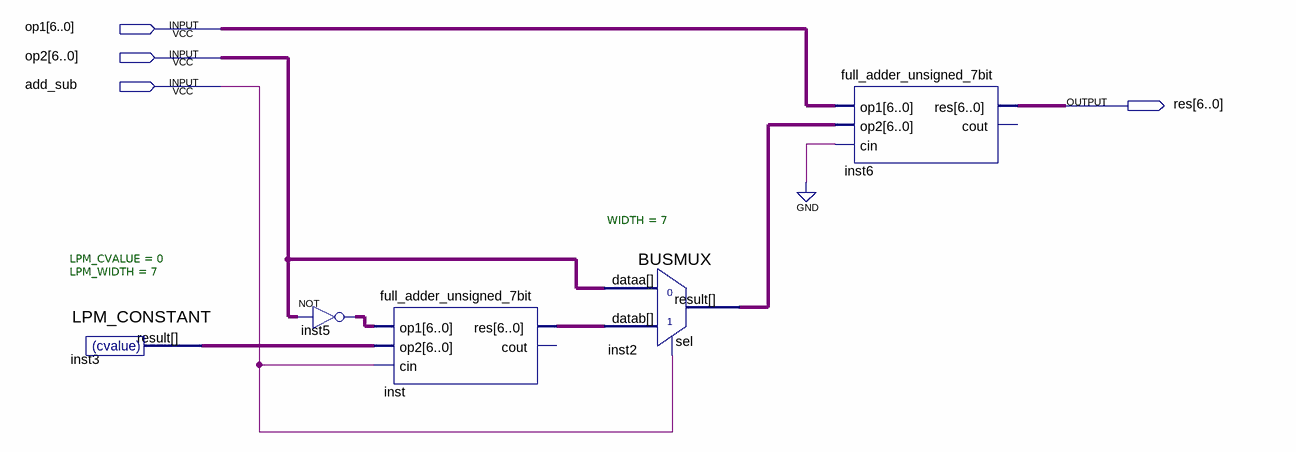
[diagram p0: schematic sheet]
// Quartus schematic addition_subtraction_7bit.bdf as structural Verilog: 5 symbols, 4 pins
module addition_subtraction_7bit (
  input  [6:0] op1,
  input  [6:0] op2,
  input  add_sub,
  output [6:0] res
);

  wire [6:0] inst2_result, inst3_result, inst5_out, inst_res;

  LPM_CONSTANT #(.LPM_CVALUE(0), .LPM_WIDTH(7)) inst3 (.result(inst3_result));
  assign inst5_out = ~op2;  // NOT inst5, 7 bits wide
  full_adder_unsigned_7bit inst (.op1(inst5_out), .op2(inst3_result), .cin(add_sub), .res(inst_res));  // open: cout
  BUSMUX #(.WIDTH(7)) inst2 (.datab(inst_res), .sel(add_sub), .dataa(op2), .result(inst2_result));
  full_adder_unsigned_7bit inst6 (.op1(op1), .op2(inst2_result), .cin(1'b0), .res(res));  // open: cout
endmodule
